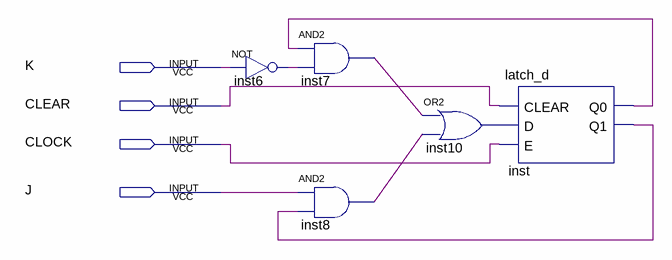
[diagram p0: schematic sheet]
// Quartus schematic flipflip_jk.bdf as structural Verilog: 5 symbols, 4 pins
module flipflip_jk (
  input  K,
  input  CLEAR,
  input  CLOCK,
  input  J
);

  wire inst6_out, inst7_out, inst8_out, inst10_out, inst_q0, inst_q1;

  not inst6 (inst6_out, K);
  and inst7 (inst7_out, inst_q0, inst6_out);
  and inst8 (inst8_out, J, inst_q1);
  or inst10 (inst10_out, inst7_out, inst8_out);
  latch_d inst (.CLEAR(CLEAR), .D(inst10_out), .E(CLOCK), .Q0(inst_q0), .Q1(inst_q1));
endmodule
